# EasyEDA schematic Самодельный вендинг_2020-09-27_06-15-33.json
TITLE: Sheet_1; REV: 1.0; Date: 2020-09-26; Sheet: 1/1; Drawn By: Rafindo Buff; Company: Your Company
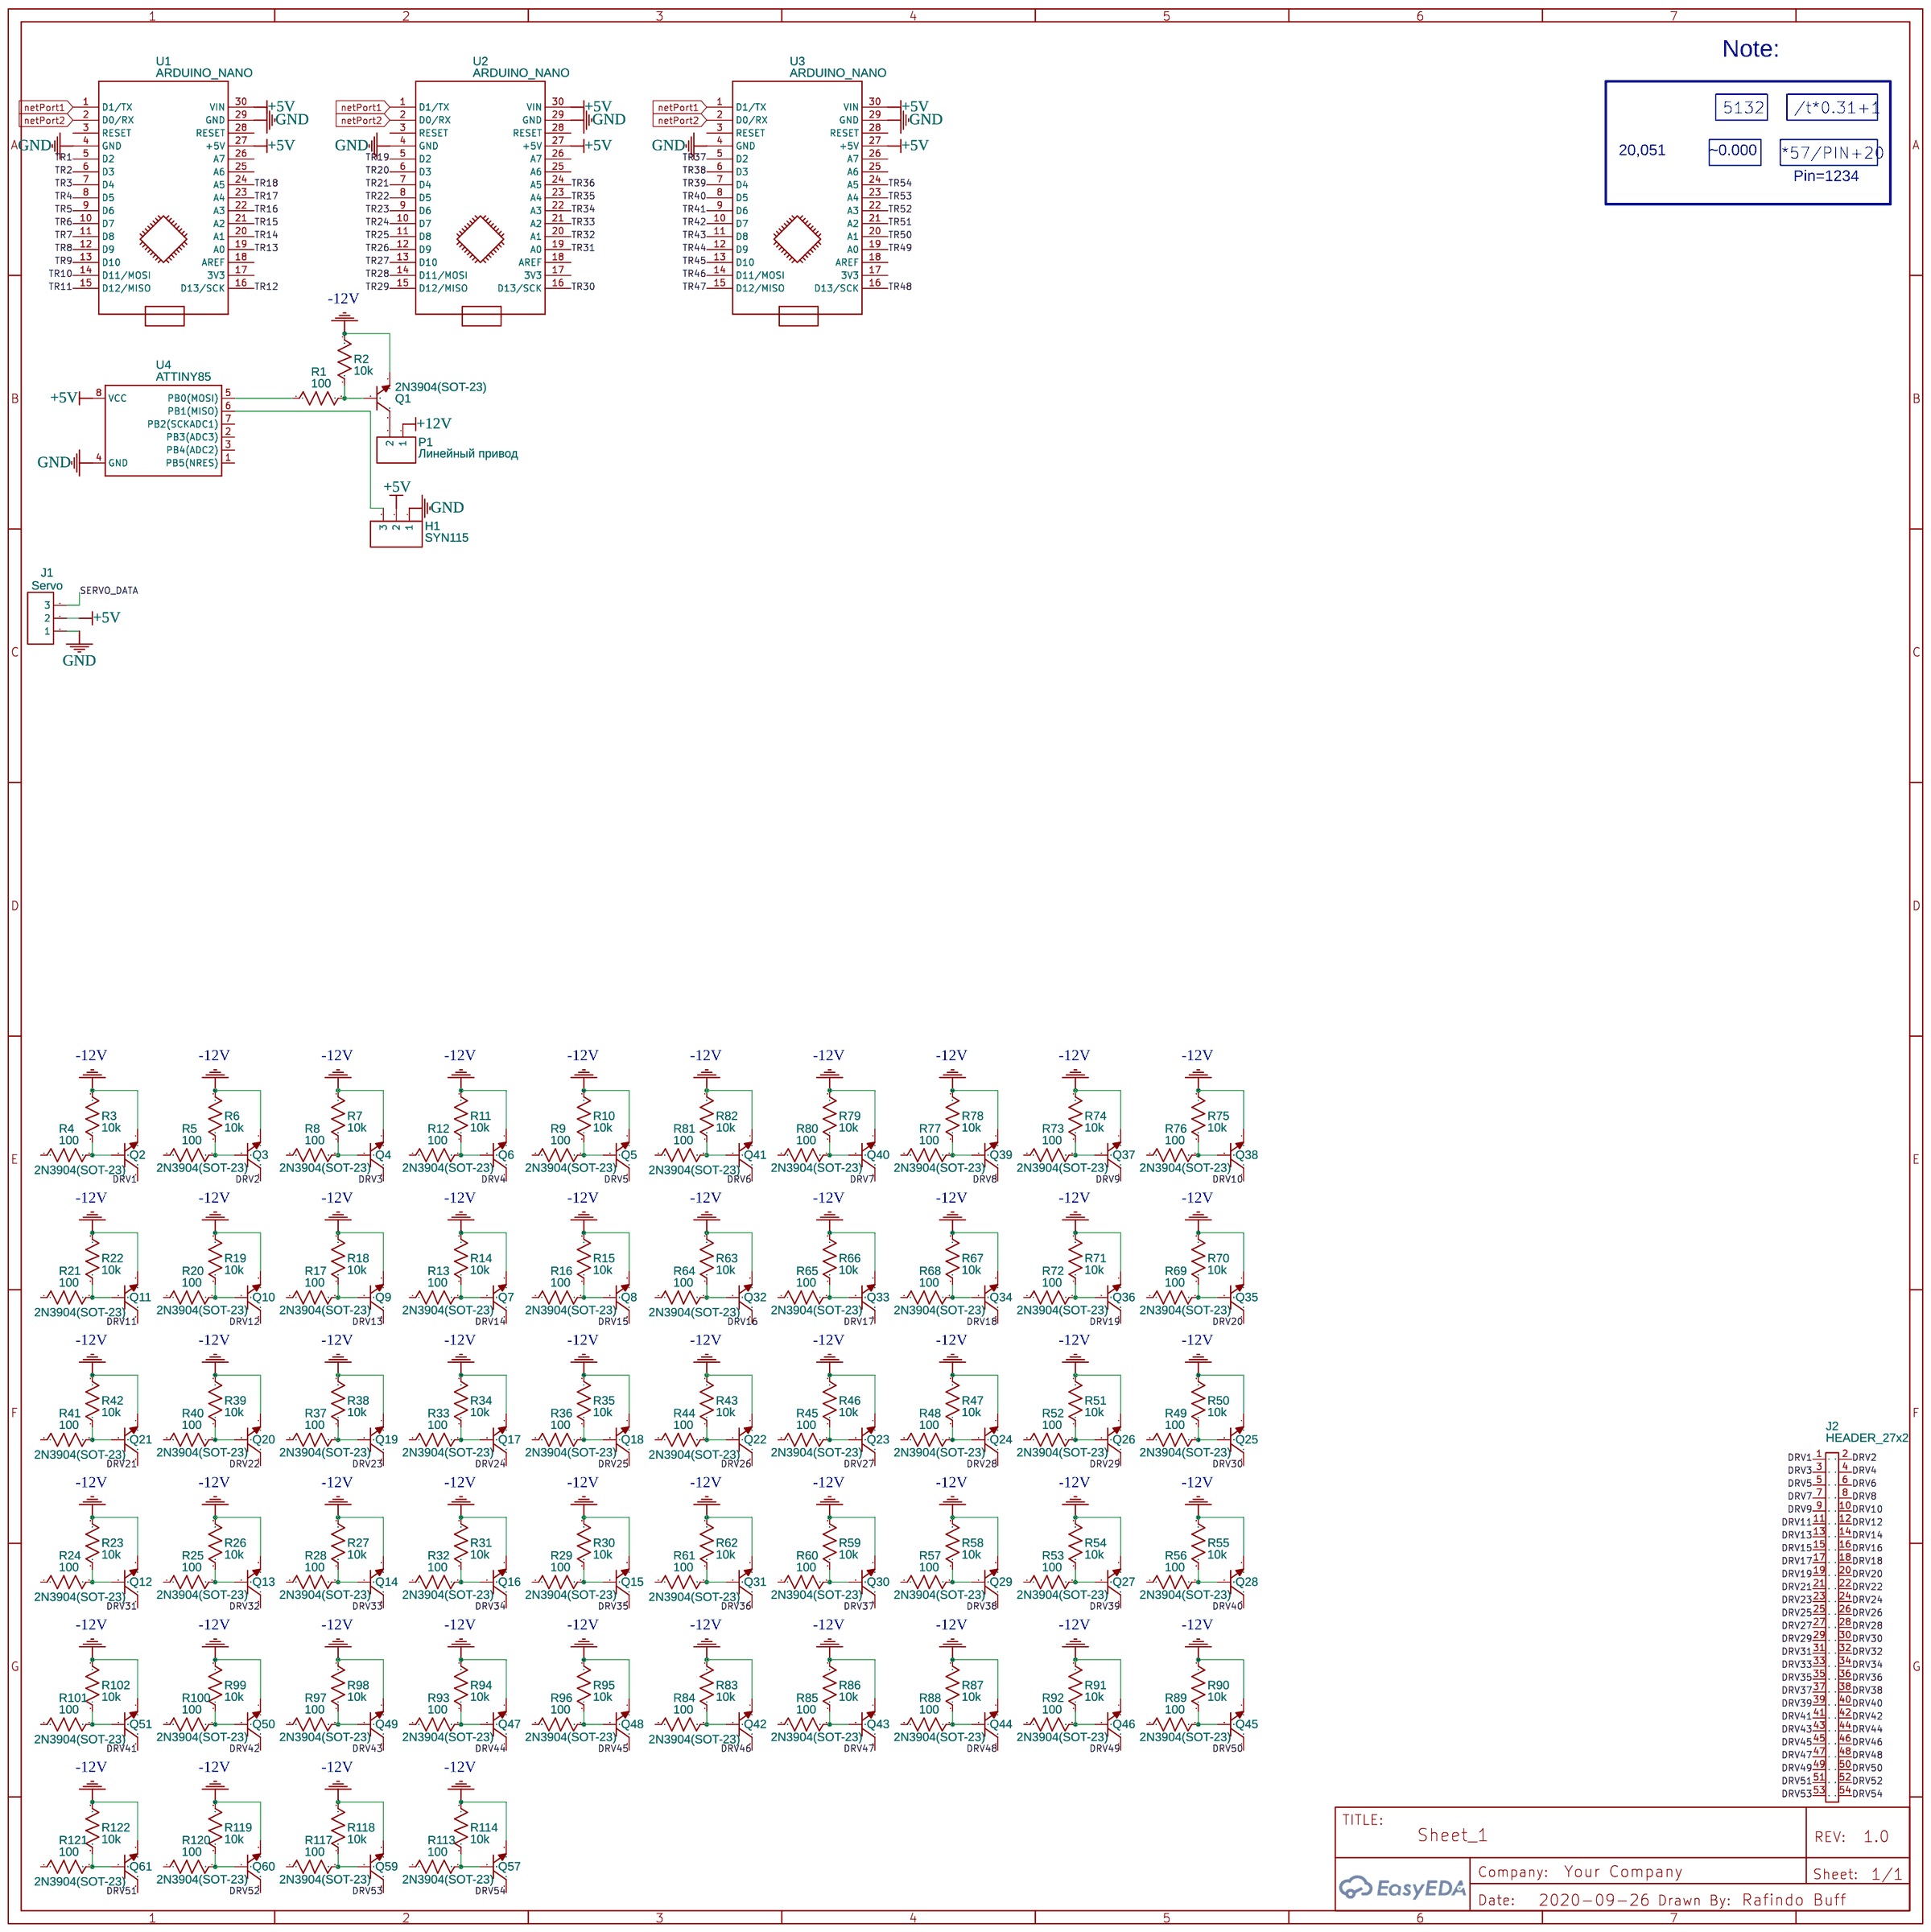
[diagram p0: schematic sheet]

## Parts
H1  SYN115  [HDR-F-2.54_1X3]
J1  Servo  [HDR-M-2.54_1X3]
J2  HEADER_27x2  [PIN_STRIP_2MM_27X2]
P1  Линейный привод  [CONN-TH_2P-P5.00]
Q1  2N3904(SOT-23)  [SOT-23-3_L2.9-W1.3-P1.90-LS2.4-TR]
Q2  2N3904(SOT-23)  [SOT-23-3_L2.9-W1.3-P1.90-LS2.4-TR]
Q3  2N3904(SOT-23)  [SOT-23-3_L2.9-W1.3-P1.90-LS2.4-TR]
Q4  2N3904(SOT-23)  [SOT-23-3_L2.9-W1.3-P1.90-LS2.4-TR]
Q5  2N3904(SOT-23)  [SOT-23-3_L2.9-W1.3-P1.90-LS2.4-TR]
Q6  2N3904(SOT-23)  [SOT-23-3_L2.9-W1.3-P1.90-LS2.4-TR]
Q7  2N3904(SOT-23)  [SOT-23-3_L2.9-W1.3-P1.90-LS2.4-TR]
Q8  2N3904(SOT-23)  [SOT-23-3_L2.9-W1.3-P1.90-LS2.4-TR]
Q9  2N3904(SOT-23)  [SOT-23-3_L2.9-W1.3-P1.90-LS2.4-TR]
Q10  2N3904(SOT-23)  [SOT-23-3_L2.9-W1.3-P1.90-LS2.4-TR]
Q11  2N3904(SOT-23)  [SOT-23-3_L2.9-W1.3-P1.90-LS2.4-TR]
Q12  2N3904(SOT-23)  [SOT-23-3_L2.9-W1.3-P1.90-LS2.4-TR]
Q13  2N3904(SOT-23)  [SOT-23-3_L2.9-W1.3-P1.90-LS2.4-TR]
Q14  2N3904(SOT-23)  [SOT-23-3_L2.9-W1.3-P1.90-LS2.4-TR]
Q15  2N3904(SOT-23)  [SOT-23-3_L2.9-W1.3-P1.90-LS2.4-TR]
Q16  2N3904(SOT-23)  [SOT-23-3_L2.9-W1.3-P1.90-LS2.4-TR]
Q17  2N3904(SOT-23)  [SOT-23-3_L2.9-W1.3-P1.90-LS2.4-TR]
Q18  2N3904(SOT-23)  [SOT-23-3_L2.9-W1.3-P1.90-LS2.4-TR]
Q19  2N3904(SOT-23)  [SOT-23-3_L2.9-W1.3-P1.90-LS2.4-TR]
Q20  2N3904(SOT-23)  [SOT-23-3_L2.9-W1.3-P1.90-LS2.4-TR]
Q21  2N3904(SOT-23)  [SOT-23-3_L2.9-W1.3-P1.90-LS2.4-TR]
Q22  2N3904(SOT-23)  [SOT-23-3_L2.9-W1.3-P1.90-LS2.4-TR]
Q23  2N3904(SOT-23)  [SOT-23-3_L2.9-W1.3-P1.90-LS2.4-TR]
Q24  2N3904(SOT-23)  [SOT-23-3_L2.9-W1.3-P1.90-LS2.4-TR]
Q25  2N3904(SOT-23)  [SOT-23-3_L2.9-W1.3-P1.90-LS2.4-TR]
Q26  2N3904(SOT-23)  [SOT-23-3_L2.9-W1.3-P1.90-LS2.4-TR]
Q27  2N3904(SOT-23)  [SOT-23-3_L2.9-W1.3-P1.90-LS2.4-TR]
Q28  2N3904(SOT-23)  [SOT-23-3_L2.9-W1.3-P1.90-LS2.4-TR]
Q29  2N3904(SOT-23)  [SOT-23-3_L2.9-W1.3-P1.90-LS2.4-TR]
Q30  2N3904(SOT-23)  [SOT-23-3_L2.9-W1.3-P1.90-LS2.4-TR]
Q31  2N3904(SOT-23)  [SOT-23-3_L2.9-W1.3-P1.90-LS2.4-TR]
Q32  2N3904(SOT-23)  [SOT-23-3_L2.9-W1.3-P1.90-LS2.4-TR]
Q33  2N3904(SOT-23)  [SOT-23-3_L2.9-W1.3-P1.90-LS2.4-TR]
Q34  2N3904(SOT-23)  [SOT-23-3_L2.9-W1.3-P1.90-LS2.4-TR]
Q35  2N3904(SOT-23)  [SOT-23-3_L2.9-W1.3-P1.90-LS2.4-TR]
Q36  2N3904(SOT-23)  [SOT-23-3_L2.9-W1.3-P1.90-LS2.4-TR]
Q37  2N3904(SOT-23)  [SOT-23-3_L2.9-W1.3-P1.90-LS2.4-TR]
Q38  2N3904(SOT-23)  [SOT-23-3_L2.9-W1.3-P1.90-LS2.4-TR]
Q39  2N3904(SOT-23)  [SOT-23-3_L2.9-W1.3-P1.90-LS2.4-TR]
Q40  2N3904(SOT-23)  [SOT-23-3_L2.9-W1.3-P1.90-LS2.4-TR]
Q41  2N3904(SOT-23)  [SOT-23-3_L2.9-W1.3-P1.90-LS2.4-TR]
Q42  2N3904(SOT-23)  [SOT-23-3_L2.9-W1.3-P1.90-LS2.4-TR]
Q43  2N3904(SOT-23)  [SOT-23-3_L2.9-W1.3-P1.90-LS2.4-TR]
Q44  2N3904(SOT-23)  [SOT-23-3_L2.9-W1.3-P1.90-LS2.4-TR]
Q45  2N3904(SOT-23)  [SOT-23-3_L2.9-W1.3-P1.90-LS2.4-TR]
Q46  2N3904(SOT-23)  [SOT-23-3_L2.9-W1.3-P1.90-LS2.4-TR]
Q47  2N3904(SOT-23)  [SOT-23-3_L2.9-W1.3-P1.90-LS2.4-TR]
Q48  2N3904(SOT-23)  [SOT-23-3_L2.9-W1.3-P1.90-LS2.4-TR]
Q49  2N3904(SOT-23)  [SOT-23-3_L2.9-W1.3-P1.90-LS2.4-TR]
Q50  2N3904(SOT-23)  [SOT-23-3_L2.9-W1.3-P1.90-LS2.4-TR]
Q51  2N3904(SOT-23)  [SOT-23-3_L2.9-W1.3-P1.90-LS2.4-TR]
Q57  2N3904(SOT-23)  [SOT-23-3_L2.9-W1.3-P1.90-LS2.4-TR]
Q59  2N3904(SOT-23)  [SOT-23-3_L2.9-W1.3-P1.90-LS2.4-TR]
Q60  2N3904(SOT-23)  [SOT-23-3_L2.9-W1.3-P1.90-LS2.4-TR]
Q61  2N3904(SOT-23)  [SOT-23-3_L2.9-W1.3-P1.90-LS2.4-TR]
R1  100  [R0603]
R2  10k  [R0603]
R3  10k  [R0603]
R4  100  [R0603]
R5  100  [R0603]
R6  10k  [R0603]
R7  10k  [R0603]
R8  100  [R0603]
R9  100  [R0603]
R10  10k  [R0603]
R11  10k  [R0603]
R12  100  [R0603]
R13  100  [R0603]
R14  10k  [R0603]
R15  10k  [R0603]
R16  100  [R0603]
R17  100  [R0603]
R18  10k  [R0603]
R19  10k  [R0603]
R20  100  [R0603]
R21  100  [R0603]
R22  10k  [R0603]
R23  10k  [R0603]
R24  100  [R0603]
R25  100  [R0603]
R26  10k  [R0603]
R27  10k  [R0603]
R28  100  [R0603]
R29  100  [R0603]
R30  10k  [R0603]
R31  10k  [R0603]
R32  100  [R0603]
R33  100  [R0603]
R34  10k  [R0603]
R35  10k  [R0603]
R36  100  [R0603]
R37  100  [R0603]
R38  10k  [R0603]
R39  10k  [R0603]
R40  100  [R0603]
R41  100  [R0603]
R42  10k  [R0603]
R43  10k  [R0603]
R44  100  [R0603]
R45  100  [R0603]
R46  10k  [R0603]
R47  10k  [R0603]
R48  100  [R0603]
R49  100  [R0603]
R50  10k  [R0603]
R51  10k  [R0603]
R52  100  [R0603]
R53  100  [R0603]
R54  10k  [R0603]
R55  10k  [R0603]
R56  100  [R0603]
R57  100  [R0603]
R58  10k  [R0603]
R59  10k  [R0603]
R60  100  [R0603]
R61  100  [R0603]
R62  10k  [R0603]
R63  10k  [R0603]
R64  100  [R0603]
R65  100  [R0603]
R66  10k  [R0603]
R67  10k  [R0603]
R68  100  [R0603]
R69  100  [R0603]
R70  10k  [R0603]
R71  10k  [R0603]
R72  100  [R0603]
R73  100  [R0603]
R74  10k  [R0603]
R75  10k  [R0603]
R76  100  [R0603]
R77  100  [R0603]
R78  10k  [R0603]
R79  10k  [R0603]
R80  100  [R0603]
R81  100  [R0603]
R82  10k  [R0603]
R83  10k  [R0603]
R84  100  [R0603]
R85  100  [R0603]
R86  10k  [R0603]
R87  10k  [R0603]
R88  100  [R0603]
R89  100  [R0603]
R90  10k  [R0603]
R91  10k  [R0603]
R92  100  [R0603]
R93  100  [R0603]
R94  10k  [R0603]
R95  10k  [R0603]
R96  100  [R0603]
R97  100  [R0603]
R98  10k  [R0603]
R99  10k  [R0603]
R100  100  [R0603]
R101  100  [R0603]
R102  10k  [R0603]
R113  100  [R0603]
R114  10k  [R0603]
R117  100  [R0603]
R118  10k  [R0603]
R119  10k  [R0603]
R120  100  [R0603]
R121  100  [R0603]
R122  10k  [R0603]
U1  ARDUINO_NANO  [ARDUINO_NANO]
U2  ARDUINO_NANO  [ARDUINO_NANO]
U3  ARDUINO_NANO  [ARDUINO_NANO]
U4  ATTINY85  [DIP08]

## Library data of the parts
H1 = HDR-F-2.54_1x3: Supplier Part: C146690; Supplier: LCSC; Contributor: LCEDA_Lib
J1 = HDR-M-2.54_1x3: Supplier Part: C180248; Supplier: LCSC; Contributor: LCEDA_Lib
J2 = HEADER_27x2
P1 = CONN-TH_2P-P5.00: Supplier: LCSC; Contributor: LCEDA_Lib
Q1-Q51 Q57 Q59-Q61 = 2N3904(SOT-23): Supplier: LCSC; Manufacturer: KEC; Manufacturer Part: 2n3904S-RTK/PS; Supplier Part: C18536; SMT Type: SOT-23; Contributor: LCEDA_Lib
R1-R102 R113 R114 R117-R122 = R_0603_US: Contributor: LCEDA_Lib
U1-U3 = ARDUINO_NANO: sourceId: KGSeAWhDB
U4 = ATTINY13: Contributor: SparkFun

## Nets
+5V: H1.2 J1.2 U1.27(+5V) U1.30(VIN) U2.27(+5V) U2.30(VIN) U3.27(+5V) U3.30(VIN) U4.8(VCC)
+12V: P1.1
-12V: Q1.1(E) Q2.1(E) Q3.1(E) Q4.1(E) Q5.1(E) Q6.1(E) Q7.1(E) Q8.1(E) Q9.1(E) Q10.1(E) Q11.1(E) Q12.1(E) Q13.1(E) Q14.1(E) Q15.1(E) Q16.1(E) Q17.1(E) Q18.1(E) Q19.1(E) Q20.1(E) Q21.1(E) Q22.1(E) Q23.1(E) Q24.1(E) Q25.1(E) Q26.1(E) Q27.1(E) Q28.1(E) Q29.1(E) Q30.1(E) Q31.1(E) Q32.1(E) Q33.1(E) Q34.1(E) Q35.1(E) Q36.1(E) Q37.1(E) Q38.1(E) Q39.1(E) Q40.1(E) Q41.1(E) Q42.1(E) Q43.1(E) Q44.1(E) Q45.1(E) Q46.1(E) Q47.1(E) Q48.1(E) Q49.1(E) Q50.1(E) Q51.1(E) Q57.1(E) Q59.1(E) Q60.1(E) Q61.1(E) R2.2 R3.2 R6.2 R7.2 R10.2 R11.2 R14.2 R15.2 R18.2 R19.2 R22.2 R23.2 R26.2 R27.2 R30.2 R31.2 R34.2 R35.2 R38.2 R39.2 R42.2 R43.2 R46.2 R47.2 R50.2 R51.2 R54.2 R55.2 R58.2 R59.2 R62.2 R63.2 R66.2 R67.2 R70.2 R71.2 R74.2 R75.2 R78.2 R79.2 R82.2 R83.2 R86.2 R87.2 R90.2 R91.2 R94.2 R95.2 R98.2 R99.2 R102.2 R114.2 R118.2 R119.2 R122.2
GND: H1.1 J1.1 U1.4(GND) U1.29(GND) U2.4(GND) U2.29(GND) U3.4(GND) U3.29(GND) U4.4(GND)
DRV1: J2.1 Q2.3(C)
DRV2: J2.2 Q3.3(C)
DRV3: J2.3 Q4.3(C)
DRV4: J2.4 Q6.3(C)
DRV5: J2.5 Q5.3(C)
DRV6: J2.6 Q41.3(C)
DRV7: J2.7 Q40.3(C)
DRV8: J2.8 Q39.3(C)
DRV9: J2.9 Q37.3(C)
DRV10: J2.10 Q38.3(C)
DRV11: J2.11 Q11.3(C)
DRV12: J2.12 Q10.3(C)
DRV13: J2.13 Q9.3(C)
DRV14: J2.14 Q7.3(C)
DRV15: J2.15 Q8.3(C)
DRV16: J2.16
DRV17: J2.17 Q33.3(C)
DRV18: J2.18 Q34.3(C)
DRV19: J2.19 Q36.3(C)
DRV20: J2.20 Q35.3(C)
DRV21: J2.21 Q21.3(C)
DRV22: J2.22 Q20.3(C)
DRV23: J2.23 Q19.3(C)
DRV24: J2.24 Q17.3(C)
DRV25: J2.25 Q18.3(C)
DRV26: J2.26 Q22.3(C)
DRV27: J2.27 Q23.3(C)
DRV28: J2.28 Q24.3(C)
DRV29: J2.29 Q26.3(C)
DRV30: J2.30 Q25.3(C)
DRV31: J2.31 Q12.3(C)
DRV32: J2.32 Q13.3(C)
DRV33: J2.33 Q14.3(C)
DRV34: J2.34 Q16.3(C)
DRV35: J2.35 Q15.3(C)
DRV36: J2.36 Q31.3(C)
DRV37: J2.37 Q30.3(C)
DRV38: J2.38 Q29.3(C)
DRV39: J2.39 Q27.3(C)
DRV40: J2.40 Q28.3(C)
DRV41: J2.41 Q51.3(C)
DRV42: J2.42 Q50.3(C)
DRV43: J2.43 Q49.3(C)
DRV44: J2.44 Q47.3(C)
DRV45: J2.45 Q48.3(C)
DRV46: J2.46 Q42.3(C)
DRV47: J2.47 Q43.3(C)
DRV48: J2.48 Q44.3(C)
DRV49: J2.49 Q46.3(C)
DRV50: J2.50 Q45.3(C)
DRV51: J2.51 Q61.3(C)
DRV52: J2.52 Q60.3(C)
DRV53: J2.53 Q59.3(C)
DRV54: J2.54 Q57.3(C)
netPort1: U1.1(D1/TX) U2.1(D1/TX) U3.1(D1/TX)
netPort2: U1.2(D0/RX) U2.2(D0/RX) U3.2(D0/RX)
SERVO_DATA: J1.3
TR1: U1.5(D2)
TR2: U1.6(D3)
TR3: U1.7(D4)
TR4: U1.8(D5)
TR5: U1.9(D6)
TR6: U1.10(D7)
TR7: U1.11(D8)
TR8: U1.12(D9)
TR9: U1.13(D10)
TR10: U1.14(D11/MOSI)
TR11: U1.15(D12/MISO)
TR12: U1.16(D13/SCK)
TR13: U1.19(A0)
TR14: U1.20(A1)
TR15: U1.21(A2)
TR16: U1.22(A3)
TR17: U1.23(A4)
TR18: U1.24(A5)
TR19: U2.5(D2)
TR20: U2.6(D3)
TR21: U2.7(D4)
TR22: U2.8(D5)
TR23: U2.9(D6)
TR24: U2.10(D7)
TR25: U2.11(D8)
TR26: U2.12(D9)
TR27: U2.13(D10)
TR28: U2.14(D11/MOSI)
TR29: U2.15(D12/MISO)
TR30: U2.16(D13/SCK)
TR31: U2.19(A0)
TR32: U2.20(A1)
TR33: U2.21(A2)
TR34: U2.22(A3)
TR35: U2.23(A4)
TR36: U2.24(A5)
TR37: U3.5(D2)
TR38: U3.6(D3)
TR39: U3.7(D4)
TR40: U3.8(D5)
TR41: U3.9(D6)
TR42: U3.10(D7)
TR43: U3.11(D8)
TR44: U3.12(D9)
TR45: U3.13(D10)
TR46: U3.14(D11/MOSI)
TR47: U3.15(D12/MISO)
TR48: U3.16(D13/SCK)
TR49: U3.19(A0)
TR50: U3.20(A1)
TR51: U3.21(A2)
TR52: U3.22(A3)
TR53: U3.23(A4)
TR54: U3.24(A5)
Net-(H1-3): H1.3 U4.6(PB1(MISO))
Net-(P1-2): P1.2 Q1.3(C)
Net-(Q1-2): Q1.2(B) R1.2 R2.1
Net-(Q2-2): Q2.2(B) R3.1 R4.2
Net-(Q3-2): Q3.2(B) R5.2 R6.1
Net-(Q4-2): Q4.2(B) R7.1 R8.2
Net-(Q5-2): Q5.2(B) R9.2 R10.1
Net-(Q6-2): Q6.2(B) R11.1 R12.2
Net-(Q7-2): Q7.2(B) R13.2 R14.1
Net-(Q8-2): Q8.2(B) R15.1 R16.2
Net-(Q9-2): Q9.2(B) R17.2 R18.1
Net-(Q10-2): Q10.2(B) R19.1 R20.2
Net-(Q11-2): Q11.2(B) R21.2 R22.1
Net-(Q12-2): Q12.2(B) R23.1 R24.2
Net-(Q13-2): Q13.2(B) R25.2 R26.1
Net-(Q14-2): Q14.2(B) R27.1 R28.2
Net-(Q15-2): Q15.2(B) R29.2 R30.1
Net-(Q16-2): Q16.2(B) R31.1 R32.2
Net-(Q17-2): Q17.2(B) R33.2 R34.1
Net-(Q18-2): Q18.2(B) R35.1 R36.2
Net-(Q19-2): Q19.2(B) R37.2 R38.1
Net-(Q20-2): Q20.2(B) R39.1 R40.2
Net-(Q21-2): Q21.2(B) R41.2 R42.1
Net-(Q22-2): Q22.2(B) R43.1 R44.2
Net-(Q23-2): Q23.2(B) R45.2 R46.1
Net-(Q24-2): Q24.2(B) R47.1 R48.2
Net-(Q25-2): Q25.2(B) R49.2 R50.1
Net-(Q26-2): Q26.2(B) R51.1 R52.2
Net-(Q27-2): Q27.2(B) R53.2 R54.1
Net-(Q28-2): Q28.2(B) R55.1 R56.2
Net-(Q29-2): Q29.2(B) R57.2 R58.1
Net-(Q30-2): Q30.2(B) R59.1 R60.2
Net-(Q31-2): Q31.2(B) R61.2 R62.1
Net-(Q32-2): Q32.2(B) R63.1 R64.2
Net-(Q33-2): Q33.2(B) R65.2 R66.1
Net-(Q34-2): Q34.2(B) R67.1 R68.2
Net-(Q35-2): Q35.2(B) R69.2 R70.1
Net-(Q36-2): Q36.2(B) R71.1 R72.2
Net-(Q37-2): Q37.2(B) R73.2 R74.1
Net-(Q38-2): Q38.2(B) R75.1 R76.2
Net-(Q39-2): Q39.2(B) R77.2 R78.1
Net-(Q40-2): Q40.2(B) R79.1 R80.2
Net-(Q41-2): Q41.2(B) R81.2 R82.1
Net-(Q42-2): Q42.2(B) R83.1 R84.2
Net-(Q43-2): Q43.2(B) R85.2 R86.1
Net-(Q44-2): Q44.2(B) R87.1 R88.2
Net-(Q45-2): Q45.2(B) R89.2 R90.1
Net-(Q46-2): Q46.2(B) R91.1 R92.2
Net-(Q47-2): Q47.2(B) R93.2 R94.1
Net-(Q48-2): Q48.2(B) R95.1 R96.2
Net-(Q49-2): Q49.2(B) R97.2 R98.1
Net-(Q50-2): Q50.2(B) R99.1 R100.2
Net-(Q51-2): Q51.2(B) R101.2 R102.1
Net-(Q57-2): Q57.2(B) R113.2 R114.1
Net-(Q59-2): Q59.2(B) R117.2 R118.1
Net-(Q60-2): Q60.2(B) R119.1 R120.2
Net-(Q61-2): Q61.2(B) R121.2 R122.1
Net-(R1-1): R1.1 U4.5(PB0(MOSI))

Not connected (* = marked no-connect by the designer): Q32 3(C); R4 1; R5 1; R8 1; R9 1; R12 1; R13 1; R16 1; R17 1; R20 1; R21 1; R24 1; R25 1; R28 1; R29 1; R32 1; R33 1; R36 1; R37 1; R40 1; R41 1; R44 1; R45 1; R48 1; R49 1; R52 1; R53 1; R56 1; R57 1; R60 1; R61 1; R64 1; R65 1; R68 1; R69 1; R72 1; R73 1; R76 1; R77 1; R80 1; R81 1; R84 1; R85 1; R88 1; R89 1; R92 1; R93 1; R96 1; R97 1; R100 1; R101 1; R113 1; R117 1; R120 1; R121 1; U1 3(RESET) 17(3V3) 18(AREF) 25(A6) 26(A7) 28(RESET); U2 3(RESET) 17(3V3) 18(AREF) 25(A6) 26(A7) 28(RESET); U3 3(RESET) 17(3V3) 18(AREF) 25(A6) 26(A7) 28(RESET); U4 1(PB5(NRES)) 2(PB3(ADC3)) 3(PB4(ADC2)) 7(PB2(SCKADC1))

## Notes on the sheet
- Note:
- 5132
- /t*0.31+1
- 20,051
- ~0.000
- *57/PIN+20
- Pin=1234
